# EAGLE schematic turbidity_sensor_module (EAGLE 6.1)
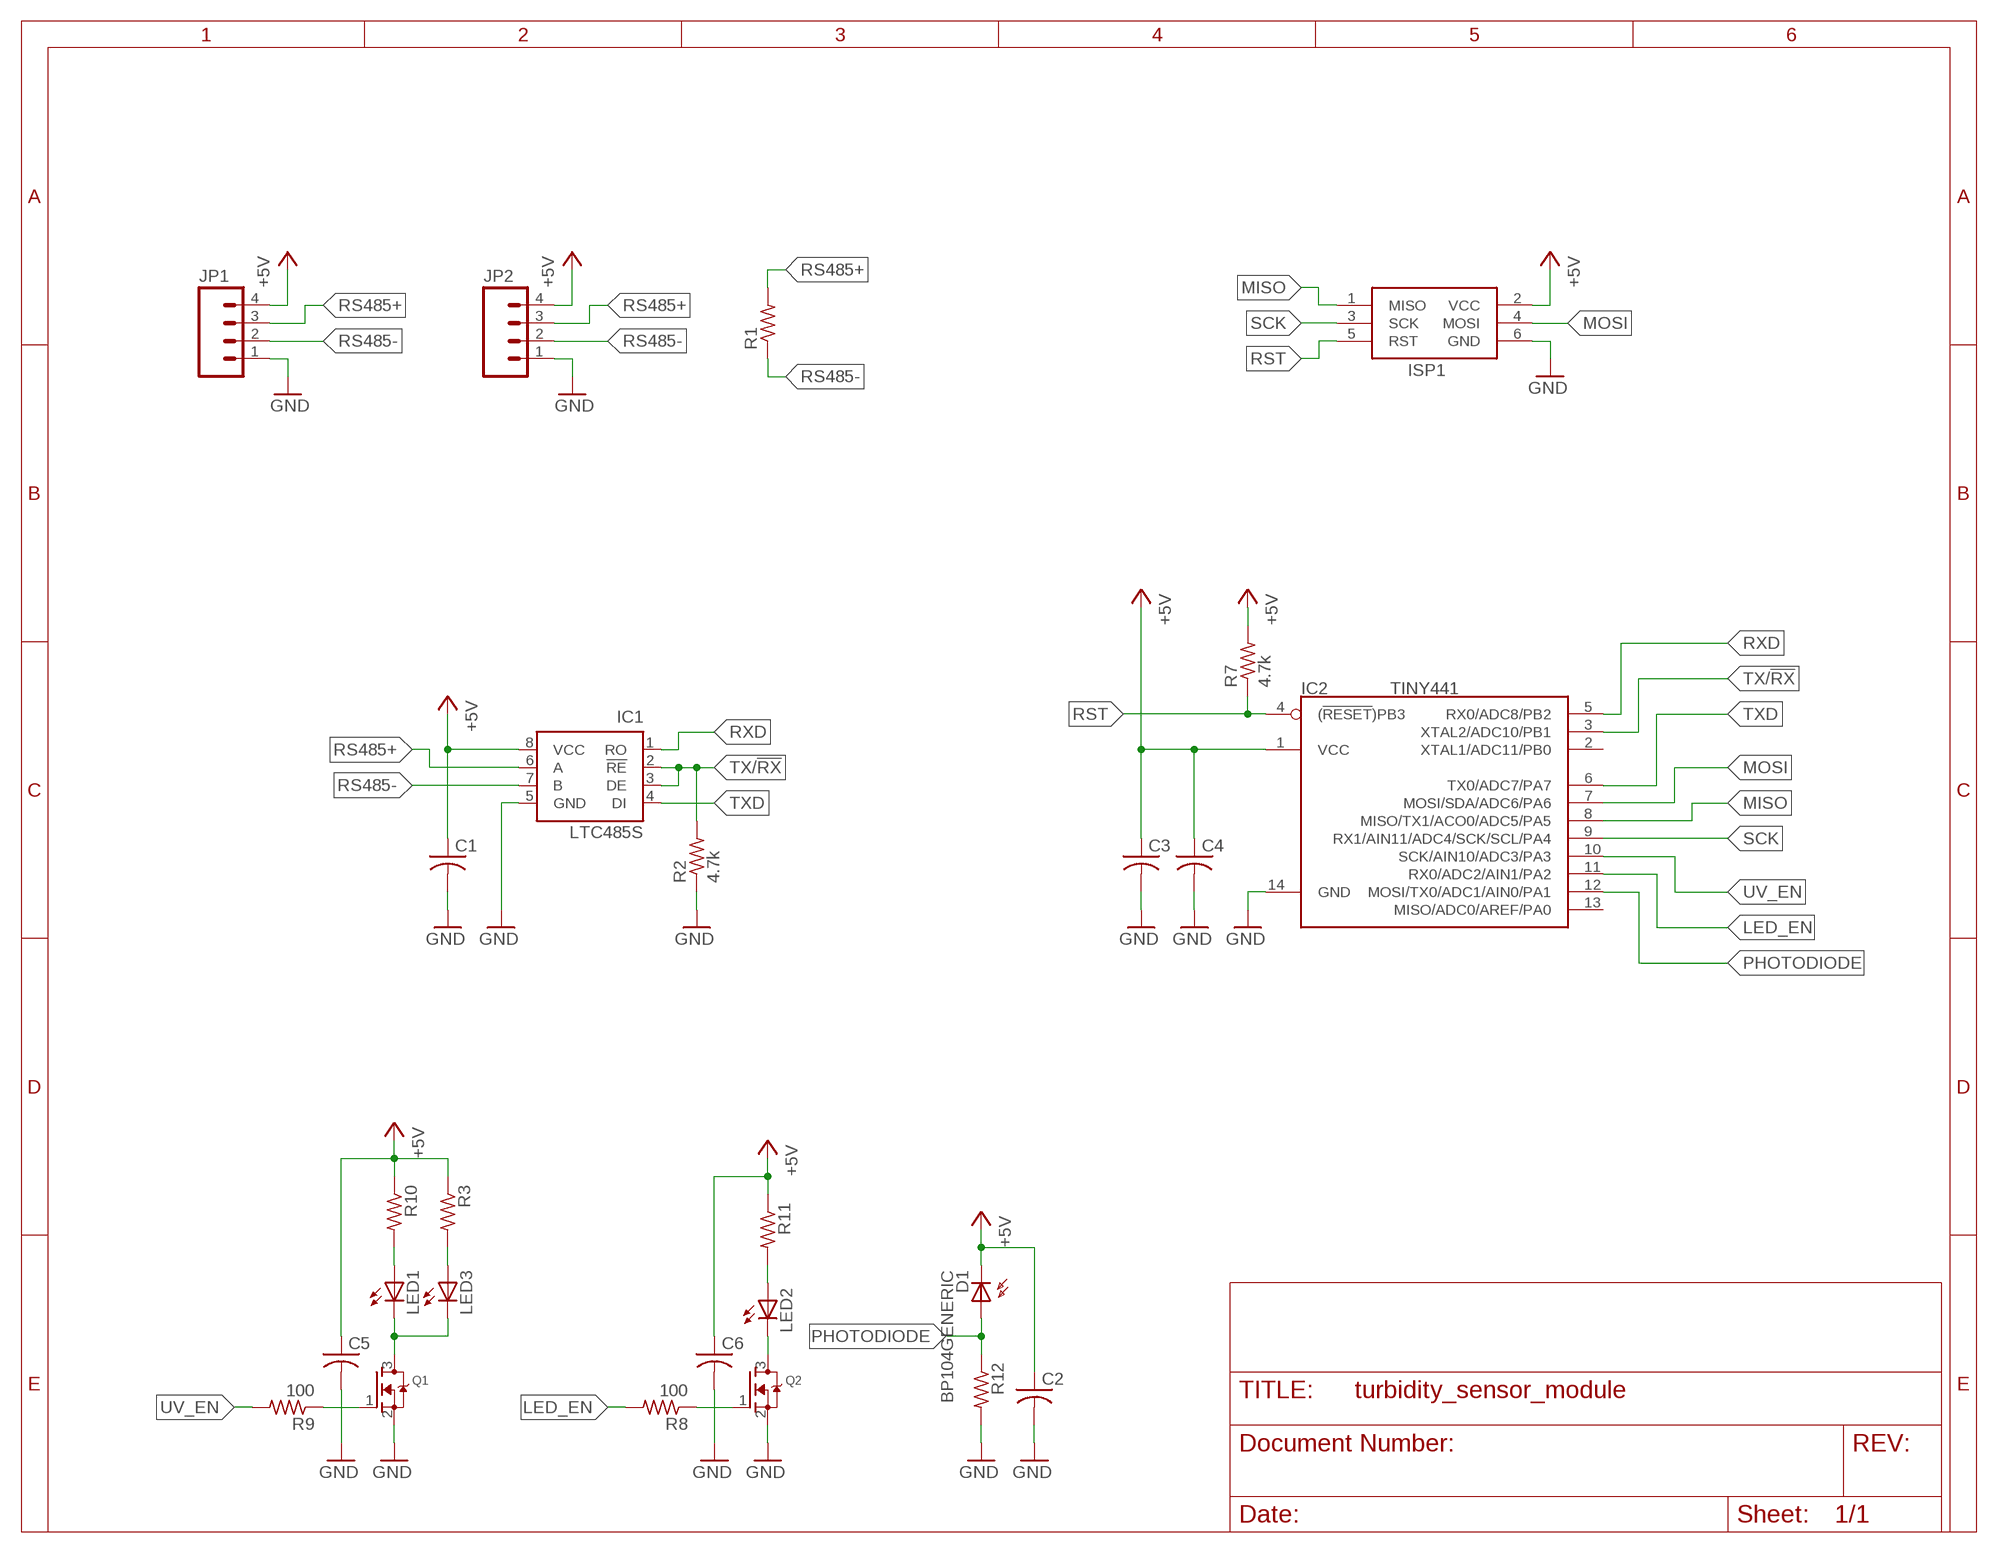
[diagram p0: schematic, sheet 1]

## Parts
C1  C-USC1206  [C1206]
C2  C-USC1206  [C1206]
C3  C-USC1206  [C1206]
C4  C-USC1206  [C1206]
C5  C-USC1206  [C1206]
C6  C-USC1206  [C1206]
D1  BP104GENERIC  [PHOTODIODE]
IC1  LTC485S  [SOIC8]
IC2  TINY441  [SOIC14]
ISP1  AVRISP-6  [AVRISP]
JP1  M04LONGPADS  [1X04_LONGPADS]
JP2  M04LONGPADS  [1X04_LONGPADS]
LED1  LED5MM  [LED5MM]
LED2  LED5MM  [LED5MM]
LED3  LED5MM  [LED5MM]
Q1  MOSFET-NREFLOW  [SOT23]
Q2  MOSFET-NREFLOW  [SOT23]
R1  R-US_R1206  [R1206]
R2  4.7k  R-US_R1206  [R1206]
R3  R-US_R1206  [R1206]
R7  4.7k  R-US_R1206  [R1206]
R8  100  R-US_R1206  [R1206]
R9  100  R-US_R1206  [R1206]
R10  R-US_R1206  [R1206]
R11  R-US_R1206  [R1206]
R12  R-US_R1206  [R1206]

## Nets
+5V: C1.1 C2.1 C3.1 C4.1 C5.1 C6.1 D1.K(C) IC1.8(VCC) IC2.1(VCC) ISP1.2(VCC) JP1.4 JP2.4 R3.1 R7.2 R10.1 R11.1
GND: C1.2 C2.2 C3.2 C4.2 C5.2 C6.2 IC1.5(GND) IC2.14(GND) ISP1.6(GND) JP1.1 JP2.1 Q1.2(S) Q2.2(S) R2.1 R12.2
LED_EN: IC2.11(RX0/ADC2/AIN1/PA2) R8.2
MISO: IC2.8(MISO/TX1/ACO0/ADC5/PA5) ISP1.1(MISO)
MOSI: IC2.7(MOSI/SDA/ADC6/PA6) ISP1.4(MOSI)
N$1: Q2.1(G) R8.1
N$2: Q1.1(G) R9.1
N$3: LED1.A R10.2
N$4: LED2.A R11.2
N$5: LED1.K(C) LED3.K(C) Q1.3(D)
N$6: LED2.K(C) Q2.3(D)
N$7: LED3.A R3.2
PHOTODIODE: D1.A IC2.12(MOSI/TX0/ADC1/AIN0/PA1) R12.1
RS485+: IC1.6(A) JP1.3 JP2.3 R1.2
RS485-: IC1.7(B) JP1.2 JP2.2 R1.1
RST: IC2.4((!RESET!)PB3) ISP1.5(RST) R7.1
RXD: IC1.1(RO) IC2.5(RX0/ADC8/PB2)
SCK: IC2.9(RX1/AIN11/ADC4/SCK/SCL/PA4) ISP1.3(SCK)
TX/!RX: IC1.2(!RE) IC1.3(DE) IC2.3(XTAL2/ADC10/PB1) R2.2
TXD: IC1.4(DI) IC2.6(TX0/ADC7/PA7)
UV_EN: IC2.10(SCK/AIN10/ADC3/PA3) R9.2
Unconnected: IC2.2(XTAL1/ADC11/PB0) IC2.13(MISO/ADC0/AREF/PA0)

## Library data of the parts
C1-C6 = adafruit:C-US: CAPACITOR, American symbol
D1 = opto-trans-siemens:BP104: PHOTO DIODE
IC1 = linear-technology:LTC485: Low Power RS485 Interface Transceiver Source: http://www.linear.com/pc/downloadDocument.do?navId=H0,C1,C1007,C1017,P2064,D1718; OC_FARNELL: unknown; OC_NEWARK: unknown
IC2 = atmel:TINY441
ISP1 = adafruit:AVRISP: AVR ISP HEADER Standard 6 pin header for AVR programming
JP1 JP2 = sparkfun:M04: Header 4 Standard 4-pin 0.1" header. Use with straight break away headers (SKU : PRT-00116), right angle break away headers (PRT-00553), swiss pins (PRT-00743), machine pins (PRT-00117), and female headers (PRT-00115). Molex polarized connector foot print use with SKU : PRT-08231 with associated crimp pins and housings. 1MM SMD Version SKU: PRT-10208
LED1-LED3 = adafruit:LED: LED OSRAM: - CHIPLED LG R971, LG N971, LY N971, LG Q971, LY Q971, LO R971, LY R971 LH N974, LH R974 LS Q976, LO Q976, LY Q976 LO Q996 - Hyper CHIPLED LW Q18S LB Q993, LB Q99A, LB R99A - SideLED LS A670, LO A670, LY A670, LG A670, LP A670 LB A673, LV A673, LT A673, LW A673 LH A674 LY A675 LS A676, LA A676, LO A676, LY A676, LW A676 LS A679, LY A679, LG A679 - Hyper Micro SIDELED® LS Y876, LA Y876, LO Y876, LY Y876 LT Y87S - SmartLED LW L88C, LW L88S LB L89C, LB L89S, LG L890 LS L89K, LO L89K, LY L89K LS L896, LA L896, LO L896, LY L896 - TOPLED LS T670, LO T670, LY T670, LG T670, LP T670 LSG T670, LSP T670, LSY T670, LOP T670, LYG T670 LG T671, LOG T671, LSG T671 LB T673, LV T673, LT T673, LW T673 LH T674 LS T676, LA T676, LO T676, LY T676, LB T676, LH T676, LSB T676, LW T676 LB T67C, LV T67C, LT T67C, LS T67K, LO T67K, LY T67K, LW E67C LS E67B, LA E67B, LO E67B, LY E67B, LB E67C, LV E67C, LT E67C LW T67C LS T679, LY T679, LG T679 LS T770, LO T770, LY T770, LG T770, LP T770 LB T773, LV T773, LT T773, LW T773 LH T774 LS E675, LA E675, LY E675, LS T675 LS T776, LA T776, LO T776, LY T776, LB T776 LHGB T686 LT T68C, LB T68C - Hyper Mini TOPLED® LB M676 - Mini TOPLED Santana® LG M470 LS M47K, LO M47K, LY M47K Source: http://www.osram.convergy.de/
Q1 Q2 = adafruit:MOSFET-N: N-Channel Mosfet 2N7002E - 60V 260mA SOT23 [Digikey: 2N7002ET1GOSTR-ND] - REEL BSH103 - 30V 850mA SOT23 [Digikey: 568-5013-1-ND]
R1-R3 R7-R12 = adafruit:R-US_: RESISTOR, American symbol